# EAGLE design PR9024 (EAGLE 6.6.0)
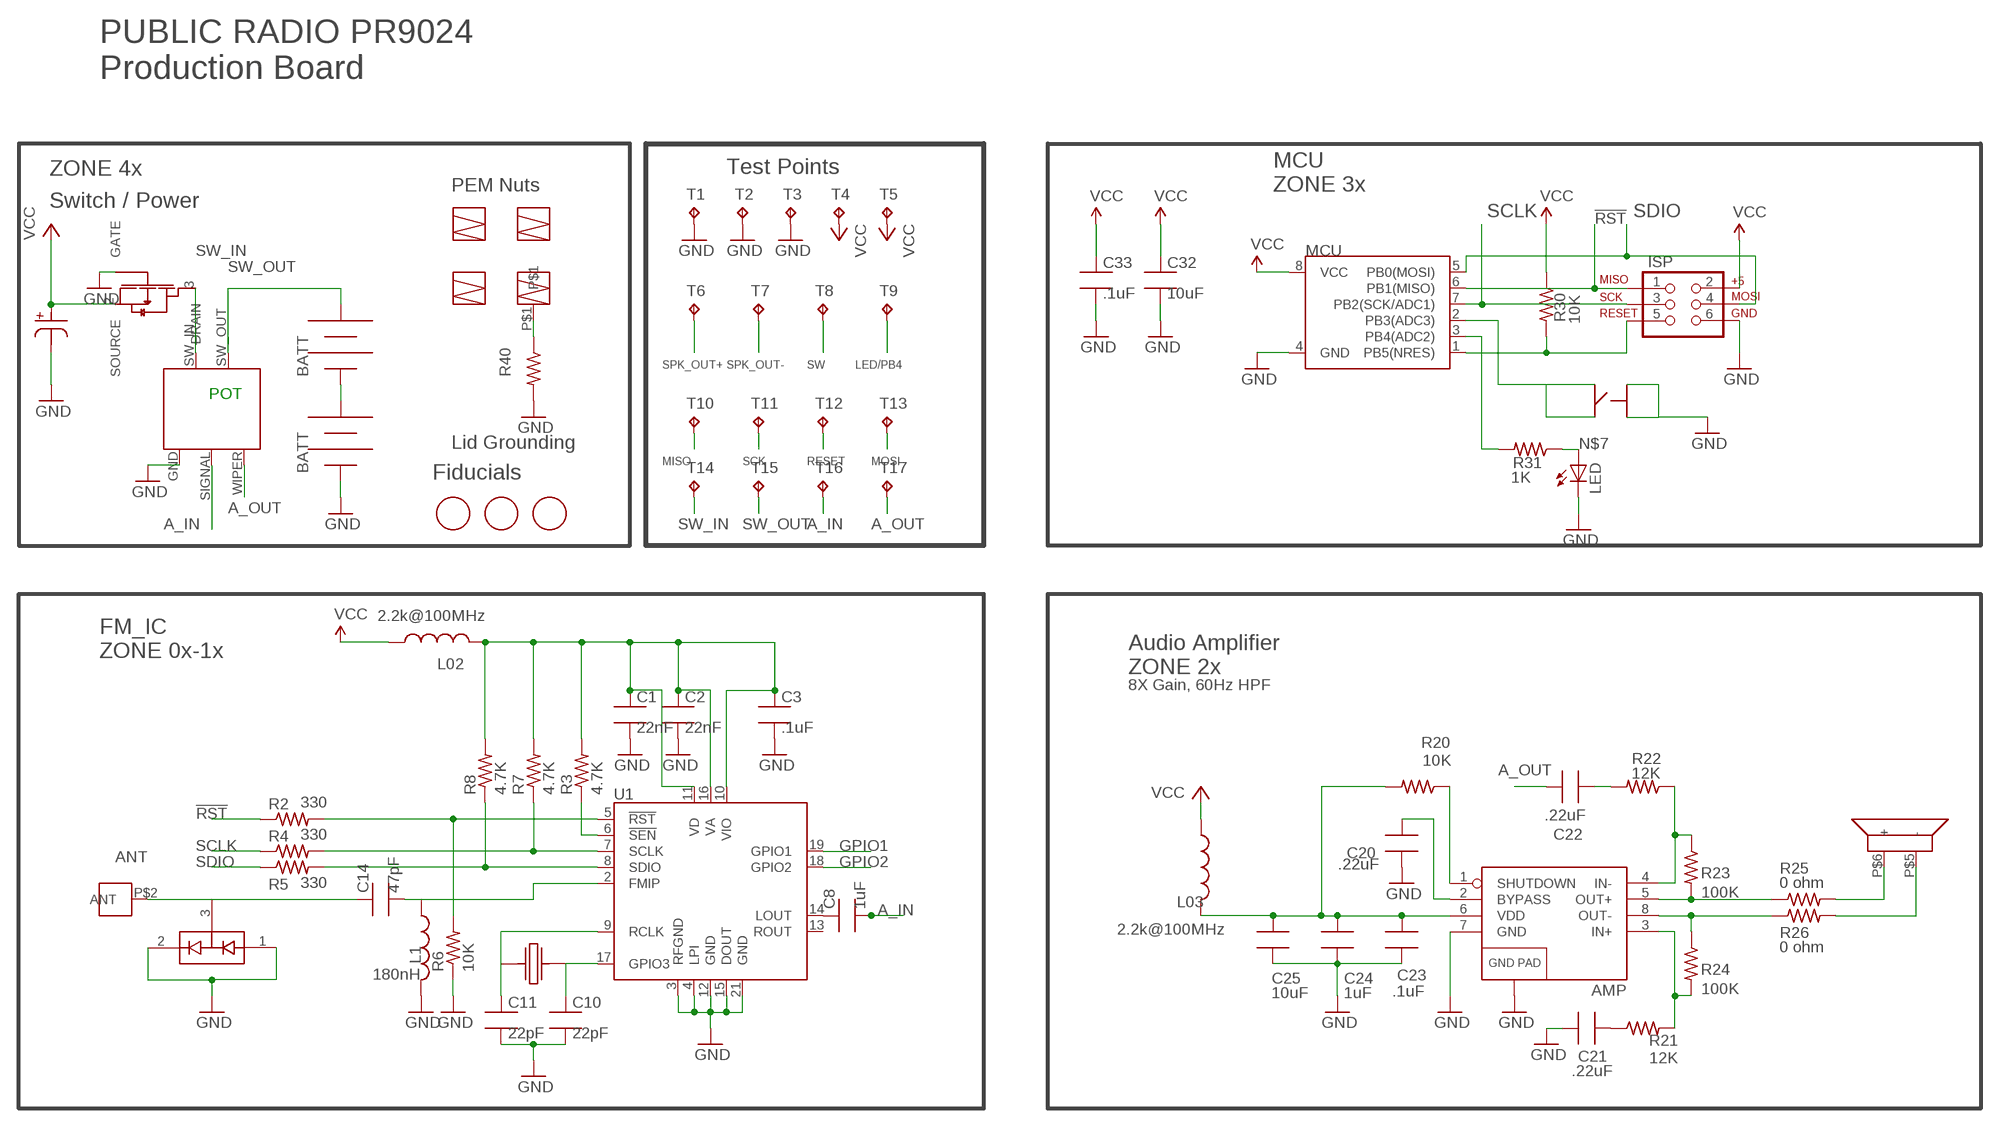
[diagram p0: schematic, sheet 1]

## Parts
AMP  TPA6203A1  [8-MSOP]
ANT_MOUNT  DNP  M3_PEMNUT  [PEM_M3]
C1  22nF  C_SMT_0603_CPL  [0603_CPL]
C2  22nF  C_SMT_0603_CPL  [0603_CPL]
C3  .1uF  C_SMT_0603_CPL  [0603_CPL]
C8  1uF  C_SMT_0603_CPL  [0603_CPL]
C10  22pF  C_SMT_0603_CPL  [0603_CPL]
C11  22pF  C_SMT_0603_CPL  [0603_CPL]
C14  47pF  C_SMT_0603_CPL  [0603_CPL]
C20  .22uF  C_SMT_0603_CPL  [0603_CPL]
C21  .22uF  C_SMT_0603_CPL  [0603_CPL]
C22  .22uF  C_SMT_0603_CPL  [0603_CPL]
C23  .1uF  C_SMT_0603_CPL  [0603_CPL]
C24  1uF  C_SMT_0603_CPL  [0603_CPL]
C25  10uF  C_SMT_0603_CPL  [0603_CPL]
C32  10uF  C_SMT_0603_CPL  [0603_CPL]
C33  .1uF  C_SMT_0603_CPL  [0603_CPL]
C40  220uF  NICHICON_SERIESUD  [NICHICON_UD_63]
D1  BAV99  [SOT23_CPL]
FET1  AO3435  [SOT23_CPL]
ISP  AVR_SPI_PRG_6NS  [2X3-NS]
JP5  BK-92_MPD_AA_BATT_CLIP  [BK92_AA_BATT]
JP6  BK-92_MPD_AA_BATT_CLIP  [BK92_AA_BATT]
L1  180nH  L_SMT_0805_ADAFRUIT  [0805_ADAFRUIT]
L02  2.2k@100MHz  L_SMT_0603_CPL  [0603_CPL]
L03  2.2k@100MHz  L_SMT_0603_CPL  [0603_CPL]
LED  HSMC-C265_REVERSE_MOUNT_LED  [HSMC-C265_REVERSE_MOUN_LED]
MARK1  FIDUCIAL  [FIDUCIAL_1MM]
MARK2  FIDUCIAL  [FIDUCIAL_1MM]
MARK3  FIDUCIAL  [FIDUCIAL_1MM]
MCU  ATTINY45TINY45-20-SMT  [8-SOIC]
R1  VOLUME_POT  [H17112NS_A10K_L20F-002]
R2  330  R_SMT_R0603_CPL  [0603_CPL]
R3  4.7K  R_SMT_R0603_CPL  [0603_CPL]
R4  330  R_SMT_R0603_CPL  [0603_CPL]
R5  330  R_SMT_R0603_CPL  [0603_CPL]
R6  10K  R_SMT_R0603_CPL  [0603_CPL]
R7  4.7K  R_SMT_R0603_CPL  [0603_CPL]
R8  4.7K  R_SMT_R0603_CPL  [0603_CPL]
R20  10K  R_SMT_R0603_CPL  [0603_CPL]
R21  12K  R_SMT_R0603_CPL  [0603_CPL]
R22  12K  R_SMT_R0603_CPL  [0603_CPL]
R23  100K  R_SMT_R0603_CPL  [0603_CPL]
R24  100K  R_SMT_R0603_CPL  [0603_CPL]
R25  0 ohm  R_SMT_0805_ADAFRUIT  [0805_ADAFRUIT]
R26  0 ohm  R_SMT_0805_ADAFRUIT  [0805_ADAFRUIT]
R30  10K  R_SMT_R0603_CPL  [0603_CPL]
R31  1K  R_SMT_R0603_CPL  [0603_CPL]
R40  DNP  R_SMT_R0603_CPL  [0603_CPL]
SPKR_PLACE  DNP  PR2024_SPKR_SMD  [PR2024_SPKR_PLACE(SMD)]
SW1  C&K_PTS645  [C&K_PTS645_SMT]
T1  TPTP20R  [TP20R]
T2  TPTP20R  [TP20R]
T3  TPTP20R  [TP20R]
T4  TPTP20R  [TP20R]
T5  TPTP20R  [TP20R]
T6  TPTP20R  [TP20R]
T7  TPTP20R  [TP20R]
T8  TPTP20R  [TP20R]
T9  TPTP20R  [TP20R]
T10  TPTP20R  [TP20R]
T11  TPTP20R  [TP20R]
T12  TPTP20R  [TP20R]
T13  TPTP20R  [TP20R]
T14  TPTP20R  [TP20R]
T15  TPTP20R  [TP20R]
T16  TPTP20R  [TP20R]
T17  TPTP20R  [TP20R]
U1  SI4702-C19-GMR  [SI470X_20_QFN]
U$2  PEM_SMT  [PEM_SMT]
U$3  PEM_SMT  [PEM_SMT]
U$4  PEM_SMT  [PEM_SMT]
U$5  PEM_M3_SMT_W/PIN  [PEM_SMT]
X1  ABS25XTAL  [4-SOJ]

## Nets
3.3V: C1.1 C2.1 C3.1 L02.2 R3.2 R7.2 R8.2 U1.10(VIO) U1.11(VD) U1.16(VA)
!RST: ISP.1 MCU.6(PB1(MISO)) R2.1 T10.TP
!RST-L: R2.2 R6.2 U1.5(!RST)
!SEN-L: R3.1 U1.6(!SEN)
A_IN: C8.2 R1.SIGNAL T16.TP
A_OUT: C22.2 R1.WIPER T17.TP
ANT [antenna]: ANT_MOUNT.P$2(ANT) C14.1 D1.3(COM)
GND: AMP.7(GND) AMP.9(GND) C1.2 C2.2 C3.2 C10.2 C11.2 C20.1 C21.1 C23.2 C24.2 C25.2 C32.2 C33.2 C40.P$2 D1.1(A1) D1.2(C2) FET1.1(GATE) ISP.6 JP6.NEG JP6.NEG@2(NEG) L1.2 LED.P$2(C) MCU.4(GND) R1.GND R6.1 R40.2 SW1.P$1 SW1.P$2 T1.TP T2.TP T3.TP U1.3(RFGND) U1.4(LPI) U1.12(GND) U1.15(DOUT) U1.21(GND)
GPIO1: U1.19(GPIO1)
GPIO2: U1.18(GPIO2)
LED/PB4: MCU.3(PB4(ADC2)) R31.2 T9.TP
N$1: C11.1 U1.9(RCLK) X1.P$1
N$2: AMP.6(VDD) C23.1 C24.1 C25.1 L03.2 R20.2
N$3: C22.1 R22.2
N$4: AMP.5(OUT+) R23.2 R25.1
N$5: AMP.3(IN+) R21.2 R24.2
N$6: R40.1 U$5.P$1
N$7: LED.P$1(A) R31.1
N$9: C8.1 U1.14(LOUT)
N$10: C10.1 U1.17(GPIO3) X1.P$4
N$11: AMP.8(OUT-) R24.1 R26.1
N$12: AMP.2(BYPASS) C20.2
N$13: JP5.NEG JP5.NEG@2(NEG) JP6.POS JP6.POS@2(POS)
N$14: AMP.4(IN-) R22.1 R23.1
N$16 [antenna]: C14.2 L1.1 U1.2(FMIP)
N$20: AMP.1(SHUTDOWN) R20.1
N$23: C21.2 R21.1
RESET: ISP.5 MCU.1(PB5(NRES)) R30.2 T12.TP
SCLK: ISP.3 MCU.7(PB2(SCK/ADC1)) R4.1 T11.TP
SCLK-L: R4.2 R7.1 U1.7(SCLK)
SDIO: ISP.4 MCU.5(PB0(MOSI)) R5.1 T13.TP
SDIO-L: R5.2 R8.1 U1.8(SDIO)
SPK_OUT+: R25.2 SPKR_PLACE.P$6(+) T6.TP
SPK_OUT-: R26.2 SPKR_PLACE.P$5(-) T7.TP
SW: MCU.2(PB3(ADC3)) SW1.P$3 SW1.P$4 T8.TP
SW_IN: FET1.3(DRAIN) R1.SW_IN T14.TP
SW_OUT: JP5.POS JP5.POS@2(POS) R1.SW_OUT T15.TP
VCC: C32.1 C33.1 C40.P$1 FET1.2(SOURCE) ISP.2 L02.1 L03.1 MCU.8(VCC) R30.1 T4.TP T5.TP
Unconnected: U1.13(ROUT)

## Notes on the sheet
- PUBLIC RADIO PR9024
  Production Board
- ZONE 4x | Test Points
- PEM Nuts
- MCU
  ZONE 3x
- Switch / Power
- POT
- Lid Grounding
- MISO | SCK | RESET | MOSI
- Fiducials
- FM_IC
  ZONE 0x-1x
- Audio Amplifier 
  ZONE 2x
- 8X Gain, 60Hz HPF

## Library data of the parts
AMP = PR_Parts_Library:TPA6203A1: IC AMP AUDIO PWR 1.25W AB 8MSOP; MFG_PN: TPA6203A1DGNR
ANT_MOUNT = PR_Parts_Library:M3_PEMNUT
C1 C2 = PR_Parts_Library:C_SMT: SMT capacitor; MFG_PN: CL10B223KB8NNNC; TOL: 10%; VOLTAGE: 16V
C3 C23 C33 = PR_Parts_Library:C_SMT: SMT capacitor; MFG_PN: CL10B104KB8SFNC; TOL: 10%; VOLTAGE: 16V
C8 C24 = PR_Parts_Library:C_SMT: SMT capacitor; MFG_PN: CL10B105KP8NNNC; TOL: 10%; VOLTAGE: 10V
C10 C11 = PR_Parts_Library:C_SMT: SMT capacitor; MFG_PN: C1608C0G1H220J080AA; TOL: 5%; VOLTAGE: 50V
C14 = PR_Parts_Library:C_SMT: SMT capacitor; MFG_PN: CL10C470JB8NCNC; TOL: 5%; VOLTAGE: 50V
C20-C22 = PR_Parts_Library:C_SMT: SMT capacitor; MFG_PN: C1608X7R1C224K080AC; TOL: 10%; VOLTAGE: 16V
C25 C32 = PR_Parts_Library:C_SMT: SMT capacitor; MFG_PN: CL10A106MQ8NNNC; TOL: 20%; VOLTAGE: 6.3V
C40 = PR_Parts_Library:NICHICON_SERIESUD: Nichicon UD Series 220uf Cap MFG# UUD1C221MCL1GS; MFG_PN: UUD1C221MCL1GS; TOL: 20%; VOLTAGE: 16V
D1 = PR_Parts_Library:BAV99: DIODE ARRAY GP 100V 215MA SOT23; MFG_PN: BAV99,215
FET1 = PR_Parts_Library:AO3435: MOSFET P-CH 20V 2.9A SOT23; MFG_PN: AO3435
ISP = PR_Parts_Library:AVR_SPI_PRG_6: DIL VERTICAL PC TAIL PIN HEADER; MFG_PN: M20-9980346
JP5 JP6 = PR_Parts_Library:BK-92_MPD_AA_BATT_CLIP: Thru hole AA battery clip pair.; MFG_PN: 2 of BK92 - supplied by CL Labs
L1 = PR_Parts_Library:L_SMT: SMT inductor; CURRENT: 400mA; DCR: 640m; MFG_PN: AISC-0805-R18J-T; TOL: 5%
L02 L03 = PR_Parts_Library:L_SMT: SMT inductor; CURRENT: 150mA; DCR: 2.3; MFG_PN: HZ0603A222R-10
LED = PR_Parts_Library:HSMC-C265_REVERSE_MOUNT_LED: HSMC-C265; MFG_PN: HSMC-C265
MARK1-MARK3 = PR_Parts_Library:FIDUCIAL: 1mm fiducial.; MFG_PN: DNP
MCU = PR_Parts_Library:ATTINY45: Atmel 8-pin 2/4/8kB flash uC; MFG_PN: ATTINY45-20SUR
R1 = PR_Parts_Library:VOLUME_POT: Switched potentiometer, vertical mount, 10K audio taper
R2 R4 R5 = PR_Parts_Library:R_SMT: SMT resistor; MFG_PN: MCR03ERTJ331; POWER: 1/10W; TOL: 5%
R3 R7 R8 = PR_Parts_Library:R_SMT: SMT resistor; MFG_PN: ERJ-3EKF4701V; POWER: 1/10W; TOL: 1%
R6 R20 R30 = PR_Parts_Library:R_SMT: SMT resistor; MFG_PN: ERJ-3GEYJ103V; POWER: 1/10W; TOL: 5%
R21 R22 = PR_Parts_Library:R_SMT: SMT resistor; MFG_PN: RC0603FR-0712KL; POWER: 1/10W; TOL: 1%
R23 R24 = PR_Parts_Library:R_SMT: SMT resistor; MFG_PN: ERJ-3EKF1003V; POWER: 1/10W; TOL: 1%
R25 R26 = PR_Parts_Library:R_SMT: SMT resistor; MFG_PN: ERJ-6GEY0R00V
R31 = PR_Parts_Library:R_SMT: SMT resistor; MFG_PN: ERJ-3EKF1001V; POWER: 1/10W; TOL: 1%
R40 = PR_Parts_Library:R_SMT: SMT resistor; MFG_PN: ERJ-3GEY0R00V
SPKR_PLACE = PR_Parts_Library:PR2024_SPKR_SMD
SW1 = PR_Parts_Library:C&K_PTS645: SWITCH TACTILE SPST-NO 0.05A 12V; MFG_PN: PTS645SM43SMTR92 LFS
T1-T17 = PR_Parts_Library:TP: Test pad; MFG_PN: DNP
U1 = PR_Parts_Library:SI4702-C19-GMR: IC FM RADIO TUNER 20-QFN; MFG_PN: Si4702 C19 GM - supplied by CL Labs
U$2-U$4 = PR_Parts_Library:PEM_SMT
U$5 = PR_Parts_Library:PEM_M3_SMT_W/PIN
X1 = PR_Parts_Library:ABS25XTAL: 4PIN 32.768 Xtal MFG# ABS25-32.768KHZ-T; MFG_PN: ABS25-32.768KHZ-T

## Net classes
1 antenna: clearance 1.27 mm

## Board
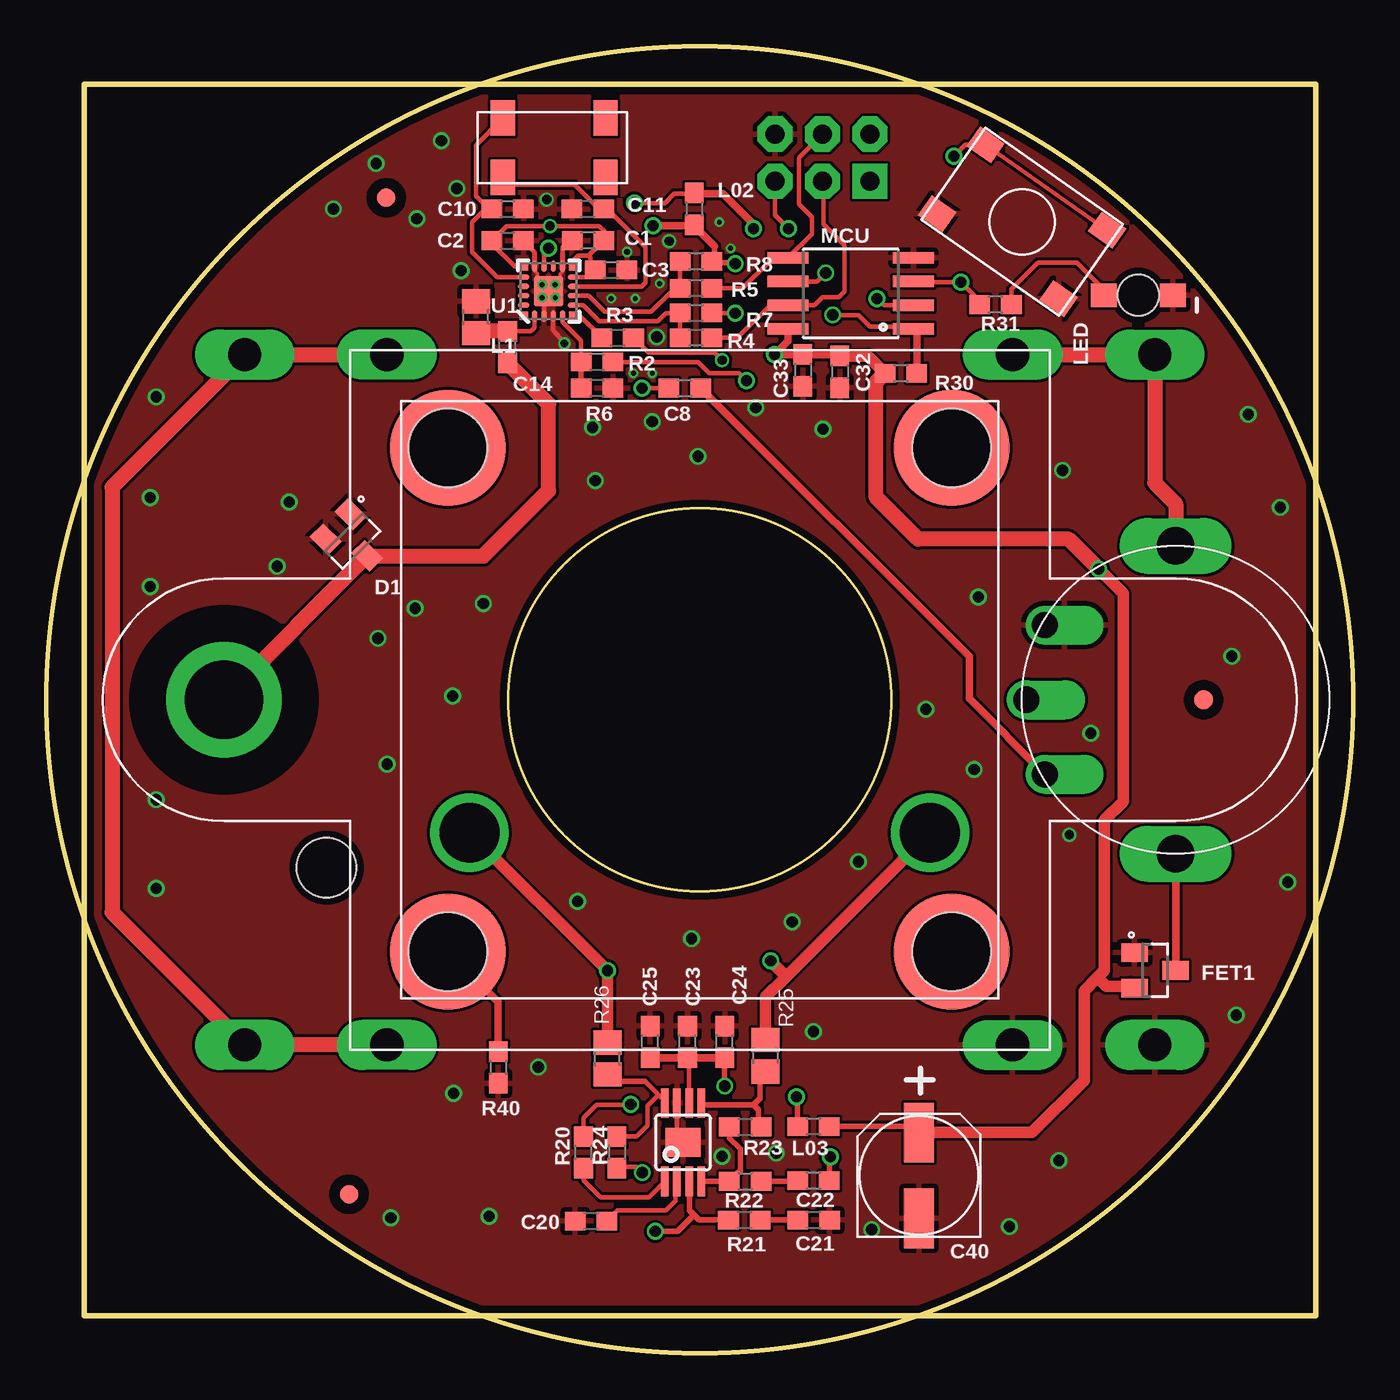
[diagram p1: board, top side]
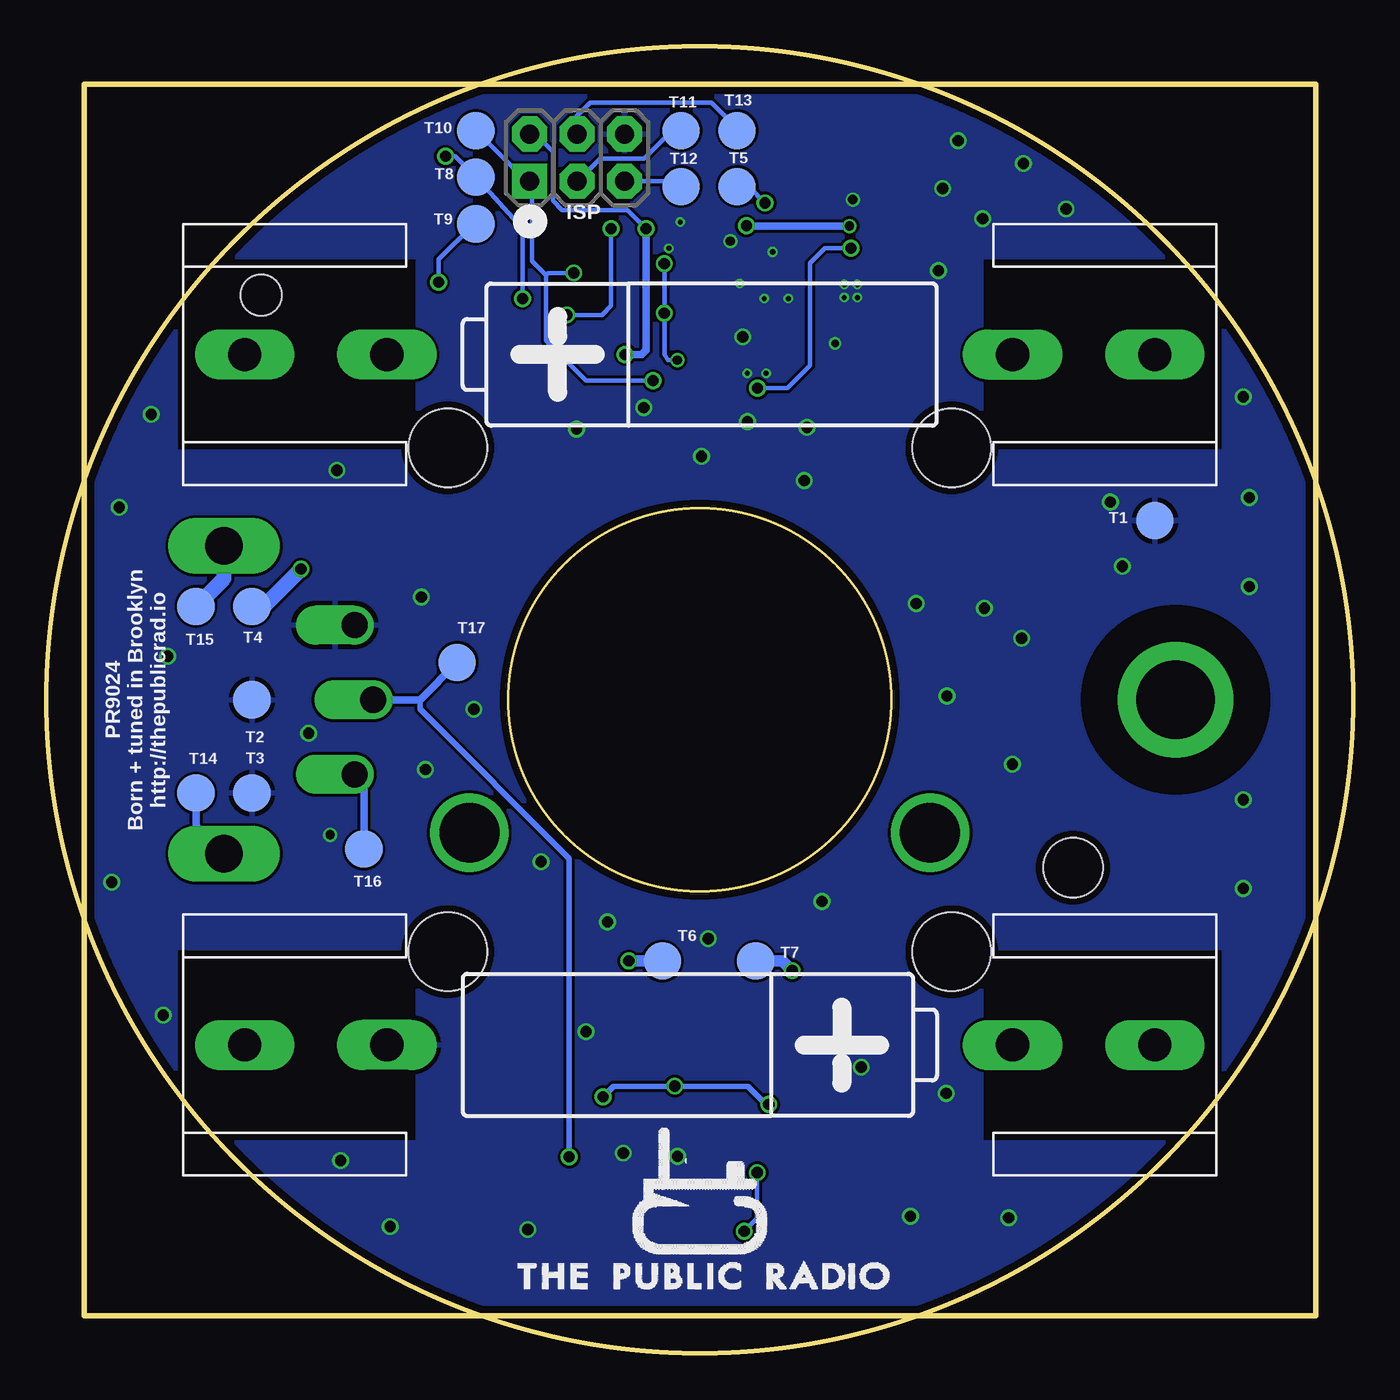
[diagram p2: board, bottom side, seen from below]

Size 70 x 70 mm. Coordinates in mm from the lower left corner, seen from the top.
Outline: 2,68 68,68 68,2 2,2 2,68
Outline: circle at 35,35 radius 35
Copper layers (1*16): Top 0.0356mm / dielectric 1.5011mm / Bottom 0.0356mm
Design rules "LaenPCBOrder *": minimum track width 6mil, minimum drill 13mil, track to track 6mil, track to pad 6mil, pad to pad 6mil, via to via 6mil, smd to smd 6mil, copper to edge 15mil, drill to drill 6mil, minimum pad ring 7mil, minimum via ring 5mil, stop-mask expansion 3mil, vias tented up to drill 0mil, thermal gap 10mil
Holes 3.2 mm at 15,26
tRestrict: area 26.1,56.1 to 27.7,57.7; 8 lines

### Footprints (pad centres in the part's own frame; a part is rotated, then mirrored left to right if it is on the bottom)
8-MSOP = smd 0.4 x 1.6: 1 -0.975,-2.1; 2 -0.325,-2.1; 3 0.325,-2.1; 4 0.975,-2.1; 5 0.975,2.1; 6 0.325,2.1; 7 -0.325,2.1; 8 -0.975,2.1 | smd 1.89 x 1.57: 9 0,0
PEM_M3 = drill 4.22 pad 6.2: P$2 0,0
0603_CPL = smd 1.1 x 1: 1 -0.85,0; 2 0.85,0
NICHICON_UD_63 = smd 1.6 x 3.2: P$1 0,2.3; P$2 0,-2.3
SOT23_CPL = smd 1.4 x 1: 1 -1.1,0.95; 2 -1.1,-0.95; 3 1.1,0
2X3-NS = drill 1.016 pad 1.88 square: 1 -2.54,-1.27 | drill 1.016 pad 1.88 octagon: 2 -2.54,1.27; 3 0,-1.27; 4 0,1.27; 5 2.54,-1.27; 6 2.54,1.27
BK92_AA_BATT = drill 1.778 long: NEG -24.384,0; NEG@2 -16.764,0; POS 16.764,0; POS@2 24.384,0
0805_ADAFRUIT = smd 1.3 x 1.5: 1 -0.85,0; 2 0.85,0
HSMC-C265_REVERSE_MOUN_LED = smd 1.4 x 1.25: P$1 -1.85,0; P$2 1.85,0 | hole 2.2: 0,0
FIDUCIAL_1MM = smd 1 x 1: 1 0,0
8-SOIC = smd 0.61 x 2.21: 1 -1.905,-3.378; 2 -0.635,-3.378; 3 0.635,-3.378; 4 1.905,-3.378; 5 1.905,3.353; 6 0.635,3.353; 7 -0.635,3.353; 8 -1.905,3.353
H17112NS_A10K_L20F-002 = drill 1.4 offset: GND -4,-7; SIGNAL 4,-7; WIPER 0,-8 | drill 2 long: SW_IN 8.25,0; SW_OUT -8.25,0
PR2024_SPKR_PLACE(SMD) = drill 3.2: P$5 -12.341,-7.125; P$6 12.341,-7.125
C&K_PTS645_SMT = smd 1.6 x 1.3: P$1 -3.975,2.25; P$2 3.975,2.25; P$3 -3.975,-2.25; P$4 3.975,-2.25
TP20R = smd 2 x 2: TP 0,0
SI470X_20_QFN = smd 0.34 x 0.34: 1 -1.275,1.265; 6 -1.265,-1.265; 11 1.265,-1.265; 16 1.265,1.265 | smd 0.61 x 0.28: 2 -1.335,0.75; 3 -1.335,0.25; 4 -1.335,-0.25; 5 -1.335,-0.75; 12 1.335,-0.75; 13 1.335,-0.25; 14 1.335,0.25; 15 1.335,0.75 | smd 0.28 x 0.61: 7 -0.75,-1.335; 8 -0.25,-1.335; 9 0.25,-1.335; 10 0.75,-1.335; 17 0.75,1.335; 18 0.25,1.335; 19 -0.25,1.335; 20 -0.75,1.335 | smd 1.6 x 1.6: 21 0,0
PEM_SMT = smd 6.2 x 6.2: P$1 0,0 | hole 4.22: 0,0
4-SOJ = smd 1.3 x 1.9: P$1 -2.75,-1.6; P$2 2.75,-1.6; P$3 2.75,1.6; P$4 -2.75,1.6

### Placement (x,y rotation side)
AMP  34.1,11.29 0 top
ANT_MOUNT  9.5,35 0 top
C1  29.01,59.6 180 top
C2  24.7,59.6 0 top
C3  30.24,58.03 0 top
C8  34.2,51.7 0 top
C10  24.7,61.3 0 top
C11  29,61.3 180 top
C14  24.7,53.9 90 top
C20  29.18,7.06 0 top
C21  41.11,7.12 180 top
C22  41.09,9.23 0 top
C23  34.34,16.66 90 top
C24  36.34,16.66 90 top
C25  32.34,16.66 90 top
C32  42.5,52.58 270 top
C33  40.52,52.65 270 top
C40  46.75,9.51 0 top
D1  16.4,43.5 315 top
FET1  59.4,20.5 0 top
ISP  41.58,64.05 0 bottom
JP5  35,53.5 180 bottom
JP6  35,16.5 0 bottom
L1  23,55.5 90 top
L02  34.7,61.3 270 top
L03  41.09,12.13 180 top
LED  58.5,56.67 0 top
MARK1  16.2,8.5 0 top
MARK2  18.2,61.9 0 top
MARK3  62,35 0 top
MCU  43.08,56.77 90 top
R1  60.5,35 270 top
R2  29.5,53.1 180 top
R3  30.6,54.4 0 top
R4  34.8,54.4 180 top
R5  34.8,57.05 180 top
R6  29.5,51.7 180 top
R7  34.8,55.73 0 top
R8  34.8,58.5 0 top
R20  28.77,10.74 90 top
R21  37.39,7.12 180 top
R22  37.44,9.19 0 top
R23  37.44,12.11 0 top
R24  30.56,10.74 270 top
R25  38.53,15.92 90 top
R26  30.05,15.78 90 top
R30  45.77,52.5 0 top
R31  50.85,56.17 180 top
R40  24.2,15.3 270 top
SPKR_PLACE  35,35 0 top
SW1  52.27,60.61 145 top
T1  10.6,44.6 0 bottom
T2  59,35 0 bottom
T3  59,30 0 bottom
T4  59,40 0 bottom
T5  33,62.5 0 bottom
T6  37,21 0 bottom
T7  32,21 0 bottom
T8  47,63 0 bottom
T9  47,60.5 0 bottom
T10  47,65.5 0 bottom
T11  36,65.5 0 bottom
T12  36,62.5 0 bottom
T13  33,65.5 0 bottom
T14  62,30 0 bottom
T15  62,40 0 bottom
T16  53,27 0 bottom
T17  48,37 0 bottom
U1  26.9,56.9 90 top
U$1  [PR_LOGO]  35,9 0 bottom
U$2  21.5,48.5 0 top
U$3  48.5,48.5 0 top
U$4  48.5,21.5 0 top
U$5  21.5,21.5 0 top
X1  27.2,64.58 0 top

### Tracks (layer width: path | path; a pad name or v marks a point on that pad's centre or on a via)
3.3V  (via drill 0.5, 0.6)
  Top 0.254: R7.2 v36.9,55.73 | 25.23,58.16 U1.16 25.6,58.2 25.1,58.2 23.85,59.45 C2.1 24.64,60.39 v26.98,60.39 29.61,60.39 29.9,60.1 29.9,59.64 C1.1 | v36.2,53.2 35.8,53.6 32.25,53.6 R3.2 | U1.10 28.35,57.65 | U1.11 28.16,58.48 28.47,58.79 29.05,58.79 | 29.05,58.79 C1.1 | 29.8,59.66 C1.1 | U1.10 29.07,57.65 C3.1 | U1.10 28.93,57.65 29.16,57.88 29.16,58.68 29.05,58.79
  Top 0.305: 35.8,59.3 35.8,58.52 R8.2 | 35.8,58.42 36.85,58.42 v36.9,58.38
  Top 0.406: 34.7,60.4 35.8,59.3 | v32.5,60.4 34.65,60.4 L02.2
  Top 0.61: L02.2 34.7,60.4 | 35.8,58.42 R8.2
  Bottom 0.254: v36.9,58.38 v36.9,55.73 36.9,53.5 36.7,53.2 v36.2,53.2
  Bottom 0.406: v26.98,60.39 32.29,60.39 v32.5,60.4
!RST  (via drill 0.6)
  Top 0.254: R2.1 34.9,53.1 35.5,52.5 37.1,52.5 v37.5,52.1 | MCU.6 41.28,57.41 v41.75,57.88
  Bottom 0.254: v41.75,57.88 43.12,57.88 43.25,57.75 | v37.5,52.1 41.1,52.1 43.25,54.25 43.25,57.75 | 43.25,57.75 44,58.5 44,62.66 ISP.1 44.37,63.03 44.53,63.03 T10.TP
!RST-L
  Top 0.254: U1.5 27.65,55.25 28.65,54.25 R2.2
  Top 0.305: R6.2 R2.2
!SEN-L
  Top 0.254: R3.1 28.52,55.63 U1.6
A_IN
  Top 0.406: C8.2 49.44,37.31 49.44,35.06 R1.SIGNAL
  Bottom 0.406: T16.TP 53,30.5 R1.SIGNAL
A_OUT  (via drill 0.6)
  Top 0.305: C22.2 41.94,10.44 v42,10.5
  Bottom 0.305: v42,10.5 42,26.5 50,34.5 50,35
  Bottom 0.406: T17.TP 50,35 R1.WIPER
ANT
  Top 0.406: 24.85,53.05 C14.1
  Top 0.813: ANT_MOUNT.P$2 9.5,35.04 D1.3 17.2,42.7 23.4,42.7 26.9,46.2 26.9,50.85 C14.1
GND  (via drill 0.25, 0.25 pad 0.1, 0.3, 0.4, 0.5, 0.6)
  Top 0.2: U1.12 27.65,57.95 27.5,57.8 27.5,57.5 v27.25,57.25 | 26.34,57.46 v26.55,57.25 26.31,57.49 26.31,57.84 26.15,58 U1.15 | 27.15,56.44 v27.26,56.55
  Top 0.254: v27.25,57.25 U1.21 | v26.55,57.25 v26.55,57.24 26.57,57.23 | U1.15 26.15,59 C2.2 | U1.12 27.65,59.25 28,59.6 C1.2 | U1.4 27.15,54.8 v27.75,54.1 | U1.3 26.65,56.45 v26.55,56.55 | AMP.7 33.77,11.61 AMP.9
  Top 0.305: 33.77,11.13 AMP.9
  Top 0.406: 33.77,11.13 33.77,10.73 33.8,10.71
  other vias: 32.45,49.9 64.4,50.3 29.4,46.75 18.45,7.24 21.8,13.9 39.95,23.1 21.15,64.95 26.35,15.31 41.6,49.5 21.98,62.4 19.84,60.78 15.37,61.31 54.25,10.3 63.75,18.1 29.25,49.6 19.75,39.9 23.4,40.15 21.75,35.2 34.9,48.05 17.65,63.74 18.25,31.55 22.21,58 38,50.65 17.75,38.3 12.35,42.15 12.99,45.59 26.8,61.81 31.1,59 32.7,54.45 41.1,17.21 47.11,34.49 49.92,40.5 54.45,47.3 30.25,56.5 31.55,56.5 32.85,57.3 36.65,59.2 36.05,60.6 32.45,52.5 31.45,52.5 33.36,59.58 54.81,27.76 44.22,6.61 34.55,22.2 28.45,24.2 5.87,24.88 5.87,29.64 5.55,41.08 5.55,45.84 5.87,51.23 23.71,7.33 66.11,45.32 66.52,25.22 63.52,37.33 51.59,6.77 36.2,10.53 39.1,10.71 55.95,33.21 49.7,31.27 43.5,26.32
  pour Bottom: 2,68 68,68 68,2 2,2
  pour Top: 2,68 68,68 68,2 2,2
LED/PB4  (via drill 0.6)
  Top 0.254: MCU.3 46.49,57.38 v49,57.38 50,56.38 R31.2
  Bottom 0.254: v49,57.38 49,58.6 47.1,60.5 T9.TP
N$1
  Top 0.254: X1.P$1 24.75,62.6 28.3,62.6 29.6,61.3 C11.1 | C11.1 29.7,61.3 | C11.1 30.05,61.3 32.1,59.25 32.1,57.36 31.89,57.15 U1.9
N$2  (via drill 0.6)
  Top 0.254: AMP.6 34.42,15.73 C23.1 | R20.2 28.77,12.61 29.47,13.3 v31.29,13.3 v31.3,13.31
  Top 0.305: C24.1 v36.34,14.29 | L03.2 40.24,13.66 v40.18,13.72
  Top 0.406: C24.1 C23.1 | C23.1 34.27,15.81 | C25.1 C23.1
  Bottom 0.305: v31.3,13.31 31.44,13.31 32.41,14.28 36.33,14.28 v36.34,14.29 39.61,14.29 v40.18,13.72
N$3
  Top 0.305: R22.2 40.2,9.19 C22.1
N$4
  Top 0.254: AMP.5 | 38.36,14.9 R25.1
  Top 0.305: AMP.5 35.16,13.3 37.87,13.3 | 37.87,13.3 38.15,13.02 38.15,12.25 R23.2 | 37.87,13.3 38.22,13.65 38.22,14.76 R25.1
  Top 0.406: R23.2 38.6,11.86
N$5  (via drill 0.6)
  Top 0.254: v31.92,9.66 31.62,9.96 30.63,9.96 R24.2
  Top 0.305: AMP.3 34.4,8.69 34.44,8.64 34.44,7.63 34.69,7.38 | R21.2 34.95,7.12 34.69,7.38 | v32.62,6.51 33.81,6.51 34.69,7.38
  Bottom 0.254: v31.92,9.66 31.92,7.21 v32.62,6.51
N$6
  Top 0.406: R40.1 24.2,18.8 U$5.P$1
N$7
  Top 0.254: 51.7,56.67 R31.1 51.7,57.01 53.12,58.44 55.2,58.44 56.65,56.99 LED.P$1 57.01,56.49
N$9  (via drill 0.6)
  Top 0.254: U1.14 26.65,58.95 v26.9,59.2 | v31.9,51.7 C8.1
  Bottom 0.254: v31.9,51.7 30.3,51.7 29.1,52.9 29.1,58.4 28.3,59.2 v26.9,59.2
N$10
  Top 0.254: U1.17 24.15,57.65 22.8,59 22.8,60.6 23.5,61.3 C10.1 | C10.1 23.8,61.2 | X1.P$4 23,64.73 23,62 23.7,61.3 C10.1
N$11
  Top 0.254: 30.55,14.71 R26.1 | AMP.8 33.12,13.49 32.8,13.82 | 32.8,13.82 32.06,14.56 | R24.1 31.61,11.59 32.2,12.18 32.2,13.23 32.8,13.82
  Top 0.305: 32.06,14.56 30.7,14.56 30.55,14.71
  Top 0.406: 33.12,12.94 AMP.8
N$12
  Top 0.254: AMP.2 33.7,8.63 33.7,8.15 33.18,7.63 30.59,7.63 C20.2
N$13
  Top 0.813: JP6.POS JP6.POS@2 3.5,23.62 3.5,46.38 JP5.NEG JP5.NEG@2
N$14
  Top 0.254: 36.89,8.94 R22.1
  Top 0.305: AMP.4 R22.1 37.17,9.78 37.17,10.92 36.59,11.5 R23.1
N$16
  Top 0.254: C14.2 25.95,54.75 26.15,54.95 U1.2
  Top 0.813: C14.2 23.1,54.75 L1.1
N$20
  Top 0.254: AMP.1 32.27,8.33 29.68,8.33 28.77,9.23 R20.1
N$21
  pour Bottom: 
N$23
  Top 0.305: C21.2 R21.1
RESET  (via drill 0.6)
  Top 0.254: ISP.5 39.03,60.97 v39.75,60.25 | v42.12,55.62 43.5,55.62 44.12,55 46.32,55 MCU.1
  Top 0.406: R30.2 46.62,54.7 MCU.1
  Bottom 0.254: ISP.5 36.28,62.78 T12.TP | v39.75,60.25 39.75,56.12 40.25,55.62 v42.12,55.62
SCLK
  Top 0.254: R4.1 37.02,54.4 38.75,56.12 39.71,56.12 MCU.7 41.14,56.14 41.58,56.58 42.45,56.58 42.75,56.88 42.75,59.38 41.62,60.5 41.62,62.73 ISP.3
  Bottom 0.254: T11.TP 36.5,65.5 38,64 40.35,64 ISP.3
SCLK-L
  Top 0.254: R4.2 R7.1 33.2,55.73 32.77,55.3 29.6,55.3 28.75,56.15 U1.7
SDIO
  Top 0.254: ISP.4 40.31,64.06 40.31,61.56 41,60.88 41,59.96 MCU.5 39.67,58.62 38.88,58.62 37.3,57.05 R5.1
  Bottom 0.254: T13.TP 33,65.62 34.38,67 40.88,67 41.62,66.25 41.62,65.37 ISP.4
SDIO-L
  Top 0.254: R5.2 R8.1 | 33.85,57 R5.2 | R5.2 33.4,56.8 32.4,55.8 29.9,55.8 29.05,56.65 U1.8
SPK_OUT+  (via drill 0.6)
  Top 0.61: SPKR_PLACE.P$6 39.48,20.02 | 39.48,20.02 38.53,19.06 R25.2 | v38.8,21 39.48,20.32 39.48,20.02
  Bottom 0.61: T6.TP v38.8,21
SPK_OUT-  (via drill 0.6)
  Top 0.61: SPKR_PLACE.P$5 v30.05,20.48 30.05,20 R26.2
  Bottom 0.61: T7.TP 30.57,21 v30.05,20.48
SW  (via drill 0.6)
  Top 0.254: 46.54,56.05 MCU.2 44.86,56.14 v44.5,56.5 | SW1.P$3 SW1.P$4 49.24,64.74 v48.62,64.12
  Bottom 0.254: v44.5,56.5 44.5,60.25 T8.TP | 47.62,62.62 47.38,62.62 T8.TP | v48.62,64.12 48.12,64.12 T8.TP
SW_IN
  Top 0.406: FET1.3 R1.SW_IN
  Bottom 0.406: R1.SW_IN 62,28.25 T14.TP
SW_OUT
  Top 0.813: JP5.POS JP5.POS@2 59.38,46.62 60.5,45.5 R1.SW_OUT
  Bottom 0.813: T15.TP 60.5,41.5 R1.SW_OUT
VCC  (via drill 0.6)
  Top 0.254: v31.5,61.62 33.12,61.62 33.62,62.12 34.67,62.12 L02.1
  Top 0.305: L03.1 46.43,12.13 C40.P$1
  Top 0.406: C32.1 42.42,53.5 C33.1 v39,53.5 39.72,54.22 MCU.8 | v37.88,60.25 37.88,60.5 36.25,62.12 34.73,62.12 L02.1
  Top 0.61: C40.P$1 52.81,11.81 55.6,14.6 55.6,19.4 56.32,20.12 | C32.1 44,53.42 R30.1 | 56.32,20.12 56.69,20.49 56.69,28.56 57.69,29.56 57.69,40.69 v56.38,42 | 58.1,19.65 56.79,19.65 56.32,20.12
  Top 0.813: 58.1,19.65 FET1.2 | R30.1 44.45,52.02 44.45,45.85 46.7,43.6 54.77,43.6 v56.38,42
  Bottom 0.254: ISP.2 43.82,65.32 42.88,64.38 42.88,61.75 42.38,61.25 38.88,61.25 v37.88,60.25 | T5.TP 32.38,62.5 v31.5,61.62
  Bottom 0.406: v39,53.5 38.12,53.5 37.88,53.75 v37.88,60.25 | T5.TP 32.88,62.5
  Bottom 0.813: T4.TP 58.38,40 v56.38,42

### Text on the board
bNames: PR9024 / Born + tuned in Brooklyn / http://thepublicrad.io